# Altium schematic sheet IOs.SchDoc
size 420 x 297 mm; ENG_APP_DATE: --/--/--; DSN_APP_DATE: --/--/--; CHK_APP_DATE: --/--/--; Date: TEST; SheetNumber: 6; SheetTotal: 6; Sheet_Text_ProjectName: ApolloEcho_Dev_Kit; Sheet_Text_Author: mtnguyen; Sheet_Text_Title: IOs; Sheet_Text_Rev: 2.0.0; Sheet_Text_Date: Mar 01, 25
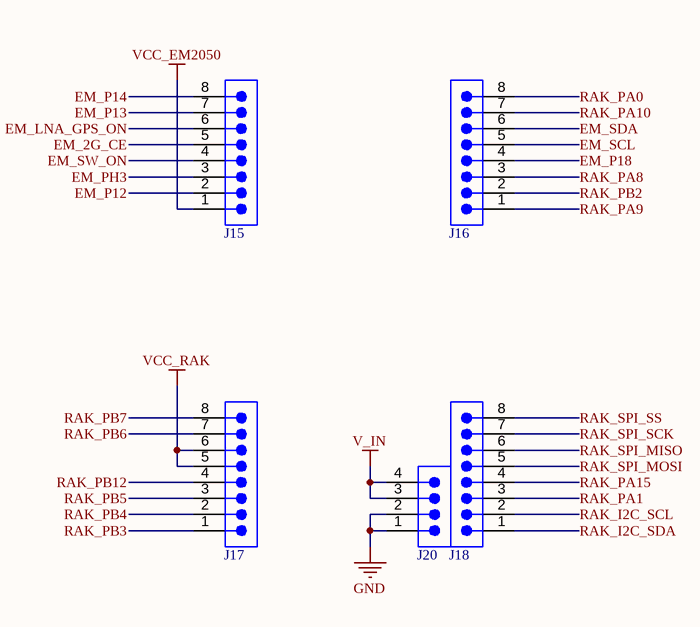
[diagram p0: IOs.SchDoc]

## Parts
J15  61300811121  [61300811121]  (value not drawn)
J16  61300811121  [61300811121]  (value not drawn)
J17  61300811121  [61300811121]  (value not drawn)
J18  61300811121  [61300811121]  (value not drawn)
J20  61300411121  [61300411121]  (value not drawn)

## Nets
GND: J20.1 J20.2
V_IN: J20.3 J20.4
VCC_EM2050: J15.1
VCC_RAK: J17.5 J17.6
EM_2G_CE: J15.5
EM_LNA_GPS_ON: J15.6
EM_P12: J15.2
EM_P13: J15.7
EM_P14: J15.8
EM_P18: J16.4
EM_PH3: J15.3
EM_SCL: J16.5
EM_SDA: J16.6
EM_SW_ON: J15.4
RAK_I2C_SCL: J18.2
RAK_I2C_SDA: J18.1
RAK_PA0: J16.8
RAK_PA1: J18.3
RAK_PA8: J16.3
RAK_PA9: J16.1
RAK_PA10: J16.7
RAK_PA15: J18.4
RAK_PB2: J16.2
RAK_PB3: J17.1
RAK_PB4: J17.2
RAK_PB5: J17.3
RAK_PB6: J17.7
RAK_PB7: J17.8
RAK_PB12: J17.4
RAK_SPI_MISO: J18.6
RAK_SPI_MOSI: J18.5
RAK_SPI_SCK: J18.7
RAK_SPI_SS: J18.8

## Notes on the sheet
- THIS DOCUMENT AND THE DATA DISCLOSED HEREIN OR
- HEREWITH IS THE PROPERTY OF ALTIUM LIMITED AND MAY
- BE FREELY DISTRIBUTED IN WHOLE. NO RIGHTS ARE
- RESERVED OR EXPRESS OR IMPLIED WARANTEE GIVEN.
- PROJECT NAME
- TITLE
- AUTHOR
- Rev.
- FILE NAME
- Date
- SHEET
- OF

## Library data of the parts
J15-J18 = CMP-1502-01076-3: NexarPartId: 32855533; Connector Type: Male Pin; Number of Contacts: 8; Voltage Rating: 250V; Current Rating: 3A; Contact Resistance: 20mΩ; Pitch: 2.54mm; Gender: Male; Termination: Solder; Contact Material: Copper; Mount: Through Hole; Lead Pitch: 2.54mm; Number of Positions: 8; Operating Supply Voltage: 250V; Number of Pins: 8; Max Operating Temperature: 105°C; Height: 8.54mm; REACH SVHC: Unknown; Number of Rows: 1; Packaging: Bulk; Contact Plating: Gold; Contact Mating Length: 5.9944mm; Orientation: Vertical; RoHS: Compliant; Color: Black; Min Operating Temperature: -40°C
J20 = CMP-1502-01064-3: NexarPartId: 32855522; Operating Supply Voltage: 250V; Pitch: 2.54mm; Contact Resistance: 20mΩ; Number of Positions: 4; Current Rating: 3A; Connector Type: Male Pin; Gender: Male; Contact Plating: Gold; Height: 8.89mm; Lead Pitch: 2.54mm; Lead Free: Lead Free; Contact Mating Length: 5.9944mm; Number of Rows: 1; Termination: Solder; Packaging: Bulk; REACH SVHC: Unknown; Min Operating Temperature: -40°C; RoHS: Compliant; Number of Contacts: 4; Voltage Rating: 250V; Color: Black; Max Operating Temperature: 105°C; Contact Material: Copper; Mount: Through Hole; Orientation: Vertical; Number of Pins: 4